# Altium project KUBODriver.PrjPcb
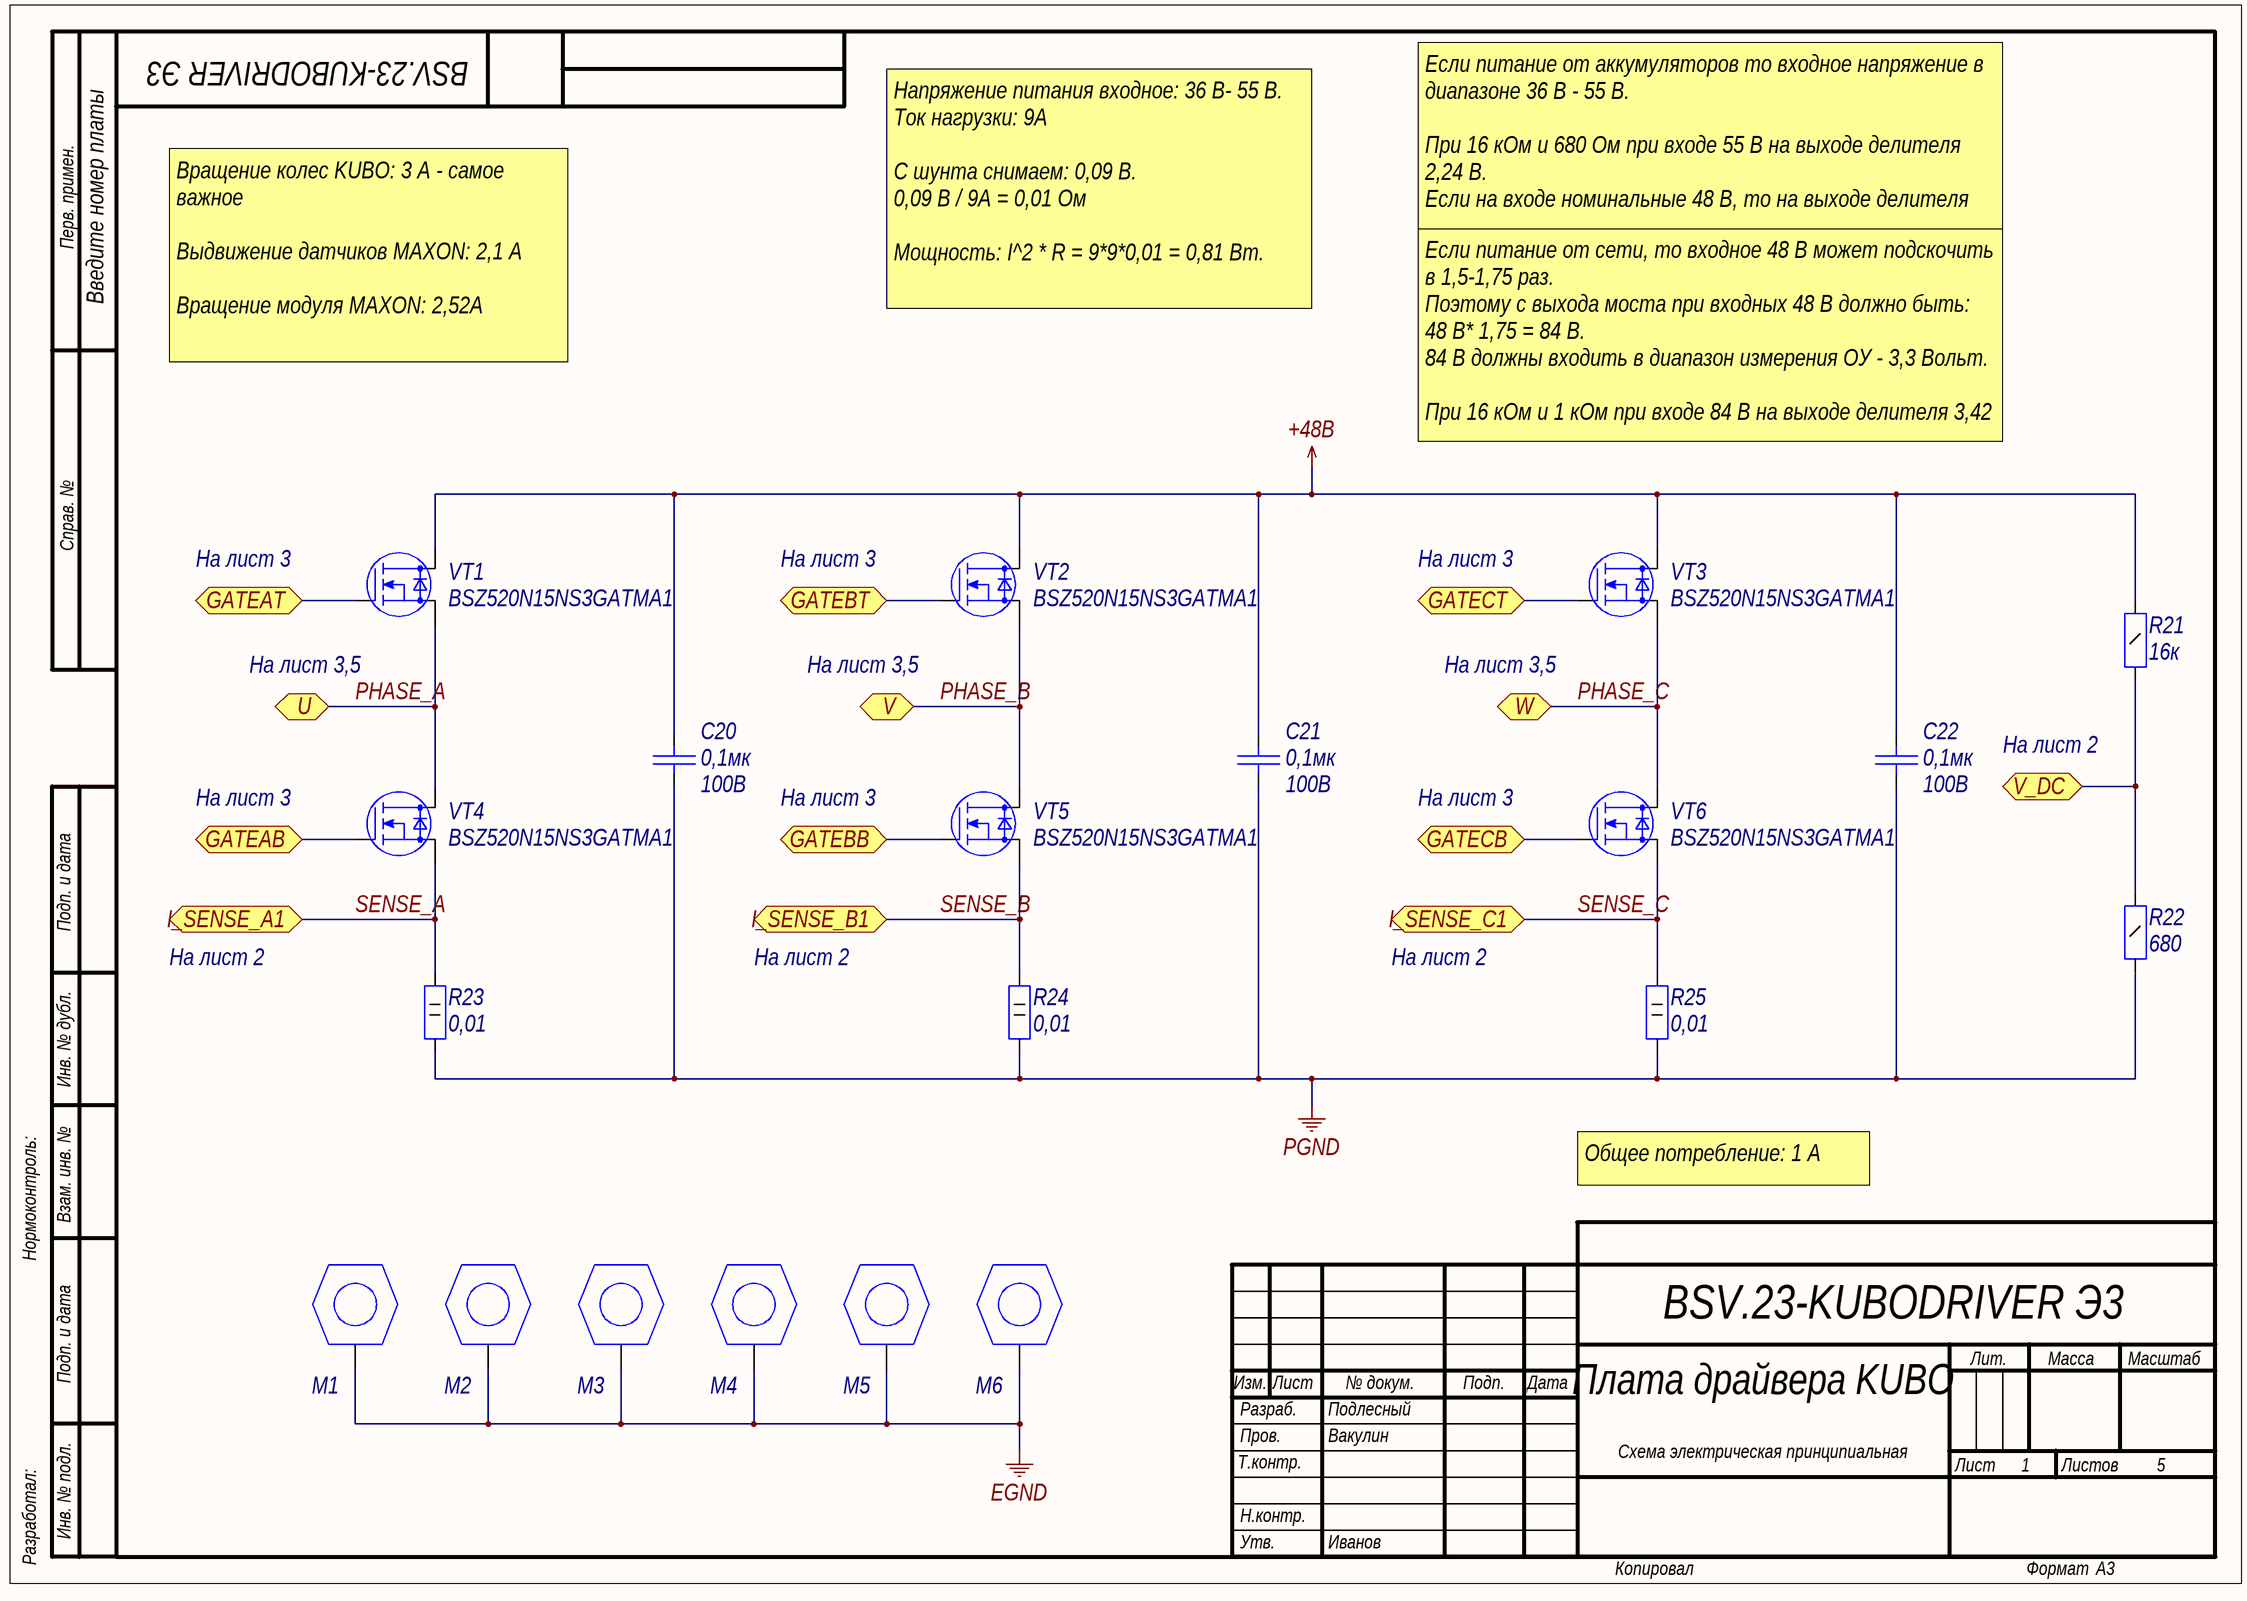
[diagram p0: KUBODriver_Bridge.SchDoc]
4 sheets, 155 parts. Net scope: flat (ports and power ports of the same name join across sheets).
Board file: KUBODriver.PcbDoc
Sheets:
  KUBODriver_Bridge.SchDoc
  KUBODriver_DC.SchDoc
  KUBODriver_Driver.SchDoc
  KUBODriver_MCU.SchDoc

## Sheet KUBODriver_Bridge.SchDoc: Плата драйвера KUBO
size 420 x 297 mm; ApprovedBy: Иванов; CheckedBy: Вакулин; DrawnBy: Подлесный; DocumentNumber: BSV.23-KUBODRIVER Э3; SheetNumber: 1; SheetTotal: 5; DocumentType: Схема электрическая принципиальная; Format: A3; ImagePath: Введите номер платы

### Parts
C20  Voltage: 100В  [C1206]  (hidden comment: 0,1мк)
C21  Voltage: 100В  [C1206]  (hidden comment: 0,1мк)
C22  Voltage: 100В  [C1206]  (hidden comment: 0,1мк)
M1  SCREW  [SCREW3]  (value not drawn)
M2  SCREW  [SCREW3]  (value not drawn)
M3  SCREW  [SCREW3]  (value not drawn)
M4  SCREW  [SCREW3]  (value not drawn)
M5  SCREW  [SCREW3]  (value not drawn)
M6  SCREW  [SCREW3]  (value not drawn)
R21  value 16к  [R1206]  (hidden comment: Resistor_0,25Вт)
R22  value 680  [R1206]  (hidden comment: Resistor_0,25Вт)
R23  0,01  [R2512]
R24  0,01  [R2512]
R25  0,01  [R2512]
VT1  Part Number: BSZ520N15NS3GATMA1  [TSDSON8]  (hidden comment: N-MOSFET)
VT2  Part Number: BSZ520N15NS3GATMA1  [TSDSON8]  (hidden comment: N-MOSFET)
VT3  Part Number: BSZ520N15NS3GATMA1  [TSDSON8]  (hidden comment: N-MOSFET)
VT4  Part Number: BSZ520N15NS3GATMA1  [TSDSON8]  (hidden comment: N-MOSFET)
VT5  Part Number: BSZ520N15NS3GATMA1  [TSDSON8]  (hidden comment: N-MOSFET)
VT6  Part Number: BSZ520N15NS3GATMA1  [TSDSON8]  (hidden comment: N-MOSFET)

### Ports
GATEAB, GATEAT, GATEBB, GATEBT, GATECB, GATECT, I_SENSE_A1, I_SENSE_B1, I_SENSE_C1, U, V, V_DC, W

### Nets
+48B: C20.2 C21.2 C22.2 R21.2 VT1.2(D) VT2.2(D) VT3.2(D)
EGND: M1.1 M2.1 M3.1 M4.1 M5.1 M6.1
PGND: C20.1 C21.1 C22.1 R22.1 R23.1 R24.1 R25.1
GATEAB: VT4.1(G) ; port GATEAB
GATEAT: VT1.1(G) ; port GATEAT
GATEBB: VT5.1(G) ; port GATEBB
GATEBT: VT2.1(G) ; port GATEBT
GATECB: VT6.1(G) ; port GATECB
GATECT: VT3.1(G) ; port GATECT
PHASE_A: VT1.3(S) VT4.2(D) ; port U
PHASE_B: VT2.3(S) VT5.2(D) ; port V
PHASE_C: VT3.3(S) VT6.2(D) ; port W
SENSE_A: R23.2 VT4.3(S) ; port I_SENSE_A1
SENSE_B: R24.2 VT5.3(S) ; port I_SENSE_B1
SENSE_C: R25.2 VT6.3(S) ; port I_SENSE_C1
V_DC: R21.1 R22.2 ; port V_DC

### Notes on the sheet
- Перв. примен.
- Если питание от аккумуляторов то входное напряжение в диапазоне 36 В - 55 B.
  При 16 кОм и 680 Ом при входе 55 В на выходе делителя 2,24 В.
  Если на входе номинальные 48 В, то на выходе делителя 1,96 В.
  Если на входе 36 В, то на выходе делителя 1,47 В.
- Напряжение питания входное: 36 B- 55 В.
  Ток нагрузки: 9А
  С шунта снимаем: 0,09 B.
  0,09 B / 9A = 0,01 Ом
  Мощность: I^2 * R = 9*9*0,01 = 0,81 Вт.
- Вращение колес KUBO: 3 А - самое важное
  Выдвижение датчиков MAXON: 2,1 А
  Вращение модуля MAXON: 2,52А
  Выдвижение УЗ датчика MAXON: 0,748А
- Если питание от сети, то входное 48 В может подскочить в 1,5-1,75 раз.
  Поэтому с выхода моста при входных 48 В должно быть:
  48 В* 1,75 = 84 В.
  84 В должны входить в диапазон измерения ОУ - 3,3 Вольт.
  При 16 кОм и 1 кОм при входе 84 В на выходе делителя 3,42 В.
- Справ. №
- На лист 3
- (near VT1) На лист 3,5
- (near VT2) На лист 3,5
- (near VT3) На лист 3,5
- На лист 2
- Подп. и дата
- Инв. № дубл.
- Нормоконтроль:
- Взам. инв. №
- Общее потребление: 1 A
- Изм.
- Лист
- № докум.
- Подп.
- Дата
- Лит.
- Масса
- Масштаб
- Т.контр.
- Пров.
- Разраб.
- Листов
- Разработал:
- Инв. № подл.
- Н.контр.
- Утв.
- Копировал
- Формат

### Library data of the parts
C20-C22 = cap286: Конденсатор; Part Name: Ceramic; Manufacture: Murata; Part Number: GRM31C5C2A104JA01L; id: cap286; TKE: NP0; Value: 0,1мк
M1-M6 = connect89: Part Name: Винт М3 с заземлением; id: connect89
R21 = res685: Резистор; Manufacture: Yageo; Part Number: RC1206FR-0716KL; id: res685; Accuracy: 0,01; Power: 0,25Вт; Part Name: Resistor
R22 = res652: Резистор; Manufacture: Yageo; Part Number: RC1206FR-07680RL; id: res652; Accuracy: 0,01; Power: 0,25Вт; Part Name: Resistor
R23-R25 = res1169: Резистор; Part Name: Shunt; Manufacture: Bourns; Part Number: CRA2512-FZ-R010ELF; Power: 2Вт; Value: 0,01; id: res1169; Accuracy: 0,01
VT1-VT6 = mosfert23: Manufacturer: Infineon Technologies; Structure: n-channel; V drain-source max: 150B; Rds: 0,052Ohm; Gate-to-source voltage: (+-)20B; Continuous drain current: 21A; Total gate charge: 12nC; Pulsed drain current: 84A; Power dissipation: 57W; id: mosfert23

## Sheet KUBODriver_DC.SchDoc
size 594 x 420 mm; DocumentNumber: BSV.23-KUBODRIVER Э3; SheetNumber: 3; Format: A2
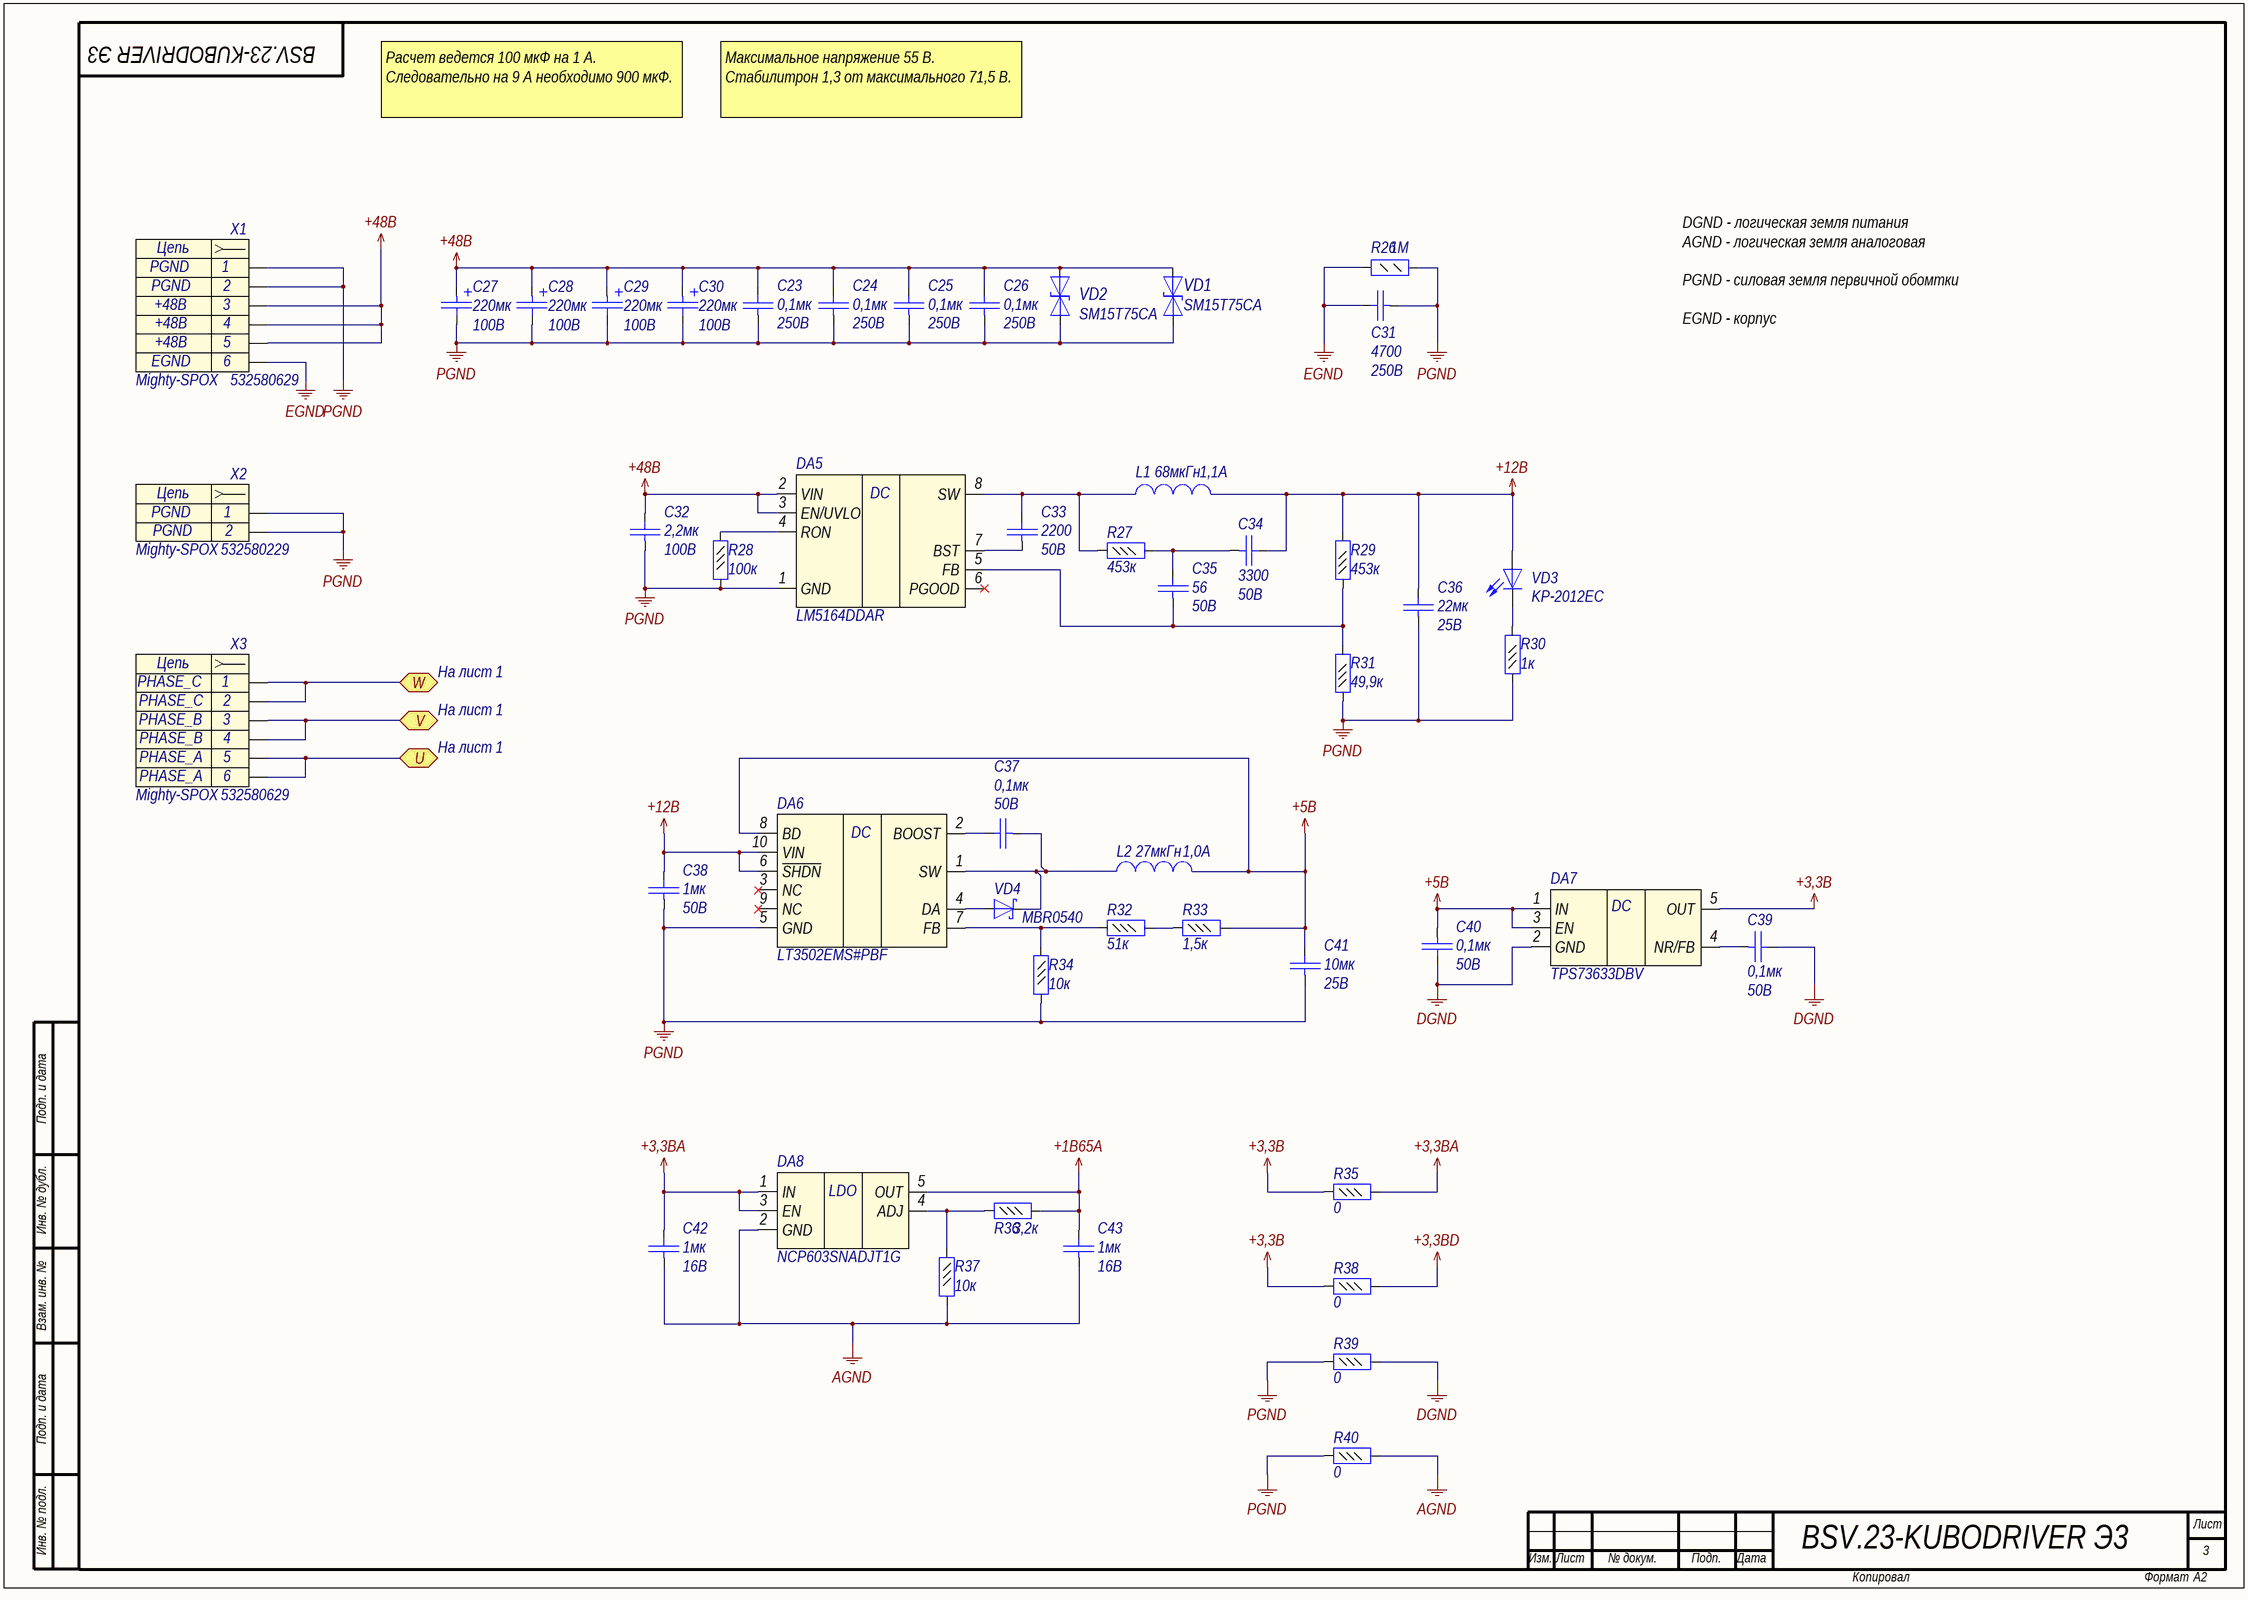
[diagram p1: KUBODriver_DC.SchDoc]

### Parts
C23  value 0,1мк  Voltage: 250В  [C1206]  (hidden comment: Capacitor)
C24  value 0,1мк  Voltage: 250В  [C1206]  (hidden comment: Capacitor)
C25  value 0,1мк  Voltage: 250В  [C1206]  (hidden comment: Capacitor)
C26  value 0,1мк  Voltage: 250В  [C1206]  (hidden comment: Capacitor)
C27  value 220мк  Voltage: 100B  [K50-35(12.5X25)_V]  (hidden comment: Capacitor_pol)
C28  value 220мк  Voltage: 100B  [K50-35(12.5X25)_V]  (hidden comment: Capacitor_pol)
C29  value 220мк  Voltage: 100B  [K50-35(12.5X25)_V]  (hidden comment: Capacitor_pol)
C30  value 220мк  Voltage: 100B  [K50-35(12.5X25)_V]  (hidden comment: Capacitor_pol)
C31  value 4700  Voltage: 250В  [C0805]  (hidden comment: Capacitor)
C32  Voltage: 100В  [C1210]  (hidden comment: 2,2мк)
C33  value 2200  Voltage: 50B  [C0402]  (hidden comment: Capacitor)
C34  value 3300  Voltage: 50В  [C0402]  (hidden comment: Capacitor)
C35  value 56  Voltage: 50B  [C0402]  (hidden comment: Capacitor)
C36  value 22мк  Voltage: 25B  [C1210]  (hidden comment: Capacitor)
C37  value 0,1мк  Voltage: 50В  [C0402]  (hidden comment: Capacitor)
C38  value 1мк  Voltage: 50B  [C0805]  (hidden comment: Capacitor)
C39  value 0,1мк  Voltage: 50В  [C0402]  (hidden comment: Capacitor)
C40  value 0,1мк  Voltage: 50В  [C0402]  (hidden comment: Capacitor)
C41  value 10мк  Voltage: 25В  [C1206]  (hidden comment: Capacitor)
C42  value 1мк  Voltage: 16B  [C0603]  (hidden comment: Capacitor)
C43  value 1мк  Voltage: 16B  [C0603]  (hidden comment: Capacitor)
DA5  Part Number: LM5164DDAR  [SO Powerpad8]  (hidden comment: LM5164)
DA6  Part Number: LT3502EMS#PBF  [MSOP10]  (hidden comment: LT3502_MS)
DA7  Part Number: TPS73633DBV  [SOT23-5]  (hidden comment: TPS736DBV)
DA8  Part Number: NCP603SNADJT1G  [TSOP5]  (hidden comment: NCP603)
L1  value 68мкГн  Rated Current: 1,1A  [SDR1006]  (hidden comment: Inductor)
L2  value 27мкГн  Rated Current: 1,0A  [SDR0604]  (hidden comment: Inductor)
R26  value 1М  [R0805]  (hidden comment: Resistor_0,125Вт)
R27  value 453к  [R0402]  (hidden comment: Resistor_0,062Вт)
R28  value 100к  [R0402]  (hidden comment: Resistor_0,062Вт)
R29  value 453к  [R0402]  (hidden comment: Resistor_0,062Вт)
R30  value 1к  [R0402]  (hidden comment: Resistor_0,062Вт)
R31  value 49,9к  [R0402]  (hidden comment: Resistor_0,062Вт)
R32  value 51к  [R0402]  (hidden comment: Resistor_0,062Вт)
R33  value 1,5к  [R0402]  (hidden comment: Resistor_0,062Вт)
R34  value 10к  [R0402]  (hidden comment: Resistor_0,062Вт)
R35  value 0  [R0603]  (hidden comment: Resistor_0,062Вт)
R36  value 3,2к  [R0402]  (hidden comment: Resistor_0,062Вт)
R37  value 10к  [R0402]  (hidden comment: Resistor_0,062Вт)
R38  value 0  [R0603]  (hidden comment: Resistor_0,062Вт)
R39  value 0  [R0603]  (hidden comment: Resistor_0,062Вт)
R40  value 0  [R0603]  (hidden comment: Resistor_0,062Вт)
VD1  Part Number: SM15T75CA  [SMC]  (hidden comment: DiodeZenerDual)
VD2  Part Number: SM15T75CA  [SMC]  (hidden comment: DiodeZenerDual)
VD3  Part Number: KP-2012EC  [L_0805]  (hidden comment: LED)
VD4  Part Number: MBR0540  [SOD-123]  (hidden comment: DiodeSchottky)
X1  Part Name: Mighty-SPOX  Part Number: 532580629  [MOLEX_532580629]  (hidden comment: Header_6_sct)
X2  Part Name: Mighty-SPOX  Part Number: 532580229  [MOLEX_532580229]  (hidden comment: Header_2_sct)
X3  Part Name: Mighty-SPOX  Part Number: 532580629  [MOLEX_532580629]  (hidden comment: Header_6_sct)

### Ports
U, V, W

### Nets
+1B65A: C43.2 DA8.5(OUT) R36.2
+3,3B: DA7.5(OUT) R35.1 R38.1
+3,3BA: C42.2 DA8.1(IN) DA8.3(EN) R35.2
+3,3BD: R38.2
+5B: C40.1 C41.2 DA6.8(BD) DA7.1(IN) DA7.3(EN) L2.2 R33.2
+12B: C34.2 C36.2 C38.2 DA6.6(~{SHDN}) DA6.10(VIN) L1.2 R29.2 VD3.2(A)
+48B: C23.2 C24.2 C25.2 C26.2 C27.1 C28.1 C29.1 C30.1 C32.2 DA5.2(VIN) DA5.3(EN/UVLO) VD1.1(K) VD2.2(A) X1.3 X1.4 X1.5
AGND: C42.1 C43.1 DA8.2(GND) R37.2 R40.2
DGND: C39.2 C40.2 DA7.2(GND) R39.2
EGND: C31.2 R26.2 X1.6
PGND: C23.1 C24.1 C25.1 C26.1 C27.2 C28.2 C29.2 C30.2 C31.1 C32.1 C36.1 C38.1 C41.1 DA5.1(GND) DA6.5(GND) R26.1 R28.2 R30.1 R31.1 R34.2 R39.1 R40.1 VD1.2(A) VD2.1(K) X1.1 X1.2 X2.1 X2.2
PHASE_A: X3.5 X3.6 ; port U
PHASE_B: X3.3 X3.4 ; port V
PHASE_C: X3.1 X3.2 ; port W
NetC33_1: C33.1 DA5.7(BST)
NetC33_2: C33.2 DA5.8(SW) L1.1 R27.1
NetC34_1: C34.1 C35.2 R27.2
NetC35_1: C35.1 DA5.5(FB) R29.1 R31.2
NetC37_1: C37.1 DA6.1(SW) L2.1 VD4.1(K)
NetC37_2: C37.2 DA6.2(BOOST)
NetC39_1: C39.1 DA7.4(NR/FB)
NetDA5_4: DA5.4(RON) R28.1
NetDA6_4: DA6.4(DA) VD4.2(A)
NetDA6_7: DA6.7(FB) R32.1 R34.1
NetDA8_4: DA8.4(ADJ) R36.1 R37.1
NetR30_2: R30.2 VD3.1(K)
NetR32_2: R32.2 R33.1

Not connected (* = marked no-connect by the designer): DA5 6(PGOOD)*; DA6 3(NC)* 9(NC)*

### Notes on the sheet
- Расчет ведется 100 мкФ на 1 А.
  Следовательно на 9 А необходимо 900 мкФ.
- Максимальное напряжение 55 В.
  Стабилитрон 1,3 от максимального 71,5 В.
- DGND - логическая земля питания
  AGND - логическая земля аналоговая
  PGND - силовая земля первичной обомтки
  EGND - корпус
- На лист 1
- Подп. и дата
- Инв. № дубл.
- Взам. инв. №
- Инв. № подл.
- Лист
- Изм.
- № докум.
- Подп.
- Дата
- Копировал
- Формат
- (in symbol connect103) Цепь
- (in symbol connect105) Цепь
- (in symbol pwr102) DC
- (in symbol pwr112) DC
- (in symbol pwr113) DC
- (in symbol pwr124) LDO

### Library data of the parts
C23-C26 = cap179: Конденсатор; Part Name: Ceramic; Manufacture: Murata; Part Number: GRM31CR72E104K; id: cap179; TKE: X7R
C27-C30 = cap279: Конденсатор полярный; Part Name: Electrolit; Manufacture: Epcos; Part Number: B41851A9227M000; id: cap279; tga: 0,10%; ESR: 75мОм; Iac max: 0,4А; Iac rated: 0,6А
C31 = cap211: Конденсатор; Part Name: Ceramic; Manufacture: Murata; Part Number: GRM21AR72E472KW; id: cap211; TKE: X7R
C32 = cap288: Конденсатор; Part Name: Ceramic; Manufacture: Murata; Part Number: GCJ32DR72A225KA01L; id: cap288; TKE: X7R; tga: 0,10%; Value: 2,2мк
C33 = cap34: Конденсатор; Part Name: Ceramic; Manufacture: Murata; Part Number: GRM155R71H222K; id: cap34; TKE: X7R
C34 = cap283: Конденсатор; Part Name: Ceramic; Manufacture: Murata; Part Number: GRM155R71H332KA01D; id: cap283; TKE: NP0; tga: 0,10%
C35 = cap16: Конденсатор; Part Name: Ceramic; Manufacture: Murata; Part Number: GRM1555C1H560J*; id: cap16; TKE: NP0
C36 = cap280: Конденсатор; Part Name: MLCC; Manufacture: Taiyo Yuden; Part Number: TMK325B7226KMHT; id: cap280; TKE: X7R; tga: 0,10%
C37 C39 C40 = cap277: Конденсатор; Part Name: Ceramic; Manufacture: Murata; Part Number: GRM155R71H104KE14D; id: cap277; TKE: X7R; tga: 0,10%
C38 = cap151: Конденсатор; Part Name: Ceramic; Manufacture: Murata; Part Number: GRM21BR71H105K; id: cap151; TKE: X7R
C41 = cap186: Конденсатор; Part Name: Ceramic; Manufacture: Murata; Part Number: GRM31CR71E106KA12L*; id: cap186; TKE: X7R
C42 C43 = cap133: Конденсатор; Part Name: Ceramic; Manufacture: Murata; Part Number: GRM188R71C105KA12D**; id: cap133; TKE: X7R
DA5 = pwr102: 1-A synchronous buck DC/DC converter with ultra-low IQ; Manufacturer: Texas Instruments; id: pwr102; Input Voltage: 6B-100B; Output Voltage: 1,2B-90B; Current: 1A; Frequency: 1MHz; Part Name: 1-A synchronous buck DC/DC converter with ultra-low IQ; Type: Impulse
DA6 = pwr112: 1.1MHz/2.2MHz, 500mA  Step-Down Regulators; Part Name: 1-A synchronous buck DC/DC converter with ultra-low IQ; Manufacturer: Linear Technology; id: pwr112; Input Voltage: 40B; Output Voltage: Adj; Current: 0,5А; Frequency: 2,2MHz; Type: Impulse
DA7 = pwr113: 400-mA Low-Dropout Regulator with Reverse Current  Protection; Manufacturer: Texas Instruments; id: pwr113; Input Voltage: 1,7-5,5В; Output Voltage: 3,3B; Dropout Voltage: 75mB; Current: 400mA; Part Name: Low-Dropout Regulator with Reverse Current Protection; Type: Linear
DA8 = pwr124: High Performance  CMOS LDO Regulator with  Enable and Enhanced ESD  Protection; Part Name: High Performance LDO Regulator with ESD Protection; Manufacturer: ON Semiconductor; id: pwr124; Input Voltage: 1,7-6В; Output Voltage: Adj; Dropout Voltage: 175mB; Current: 300mA; Type: Linear
L1 = ind109: EMI Suppression Filter; Part Name: SMD Power Inductors; Part Number: SDR1006- 680KL; Manufacture: Bourns; id: ind109; Saturation Current: 2,0A; Resistance: 0,22Ohm
L2 = ind47: EMI Suppression Filter; Part Name: SMD Power Inductors; Part Number: SDR0604- 270YL; Manufacture: Bourns; id: ind47; Saturation Current: 1,3A; Resistance: 0,22Ohm
R26 = res149: Резистор; Manufacture: Yageo; Part Number: RC0805FR-071ML; id: res149; Accuracy: 0,01; Part Name: Resistor; Power: 0,125Вт
R27 R29 = res1155: Резистор; Manufacture: Yageo; Part Number: RC0402FR-07453KL; Accuracy: 0,01; id: res1155; Part Name: Resistor; Power: 0,062Вт
R28 = res318: Резистор; Manufacture: Yageo; Part Number: RC0402FR-07100KL; id: res318; Accuracy: 0,01; Part Name: Resistor; Power: 0,062Вт
R30 = res270: Резистор; Manufacture: Yageo; Part Number: RC0402FR-071KL; id: res270; Accuracy: 0,01; Part Name: Resistor; Power: 0,062Вт
R31 = res1159: Резистор; Manufacture: Yageo; Part Number: RC0402FR-0749K9L; Accuracy: 0,01; id: res1159; Part Name: Resistor; Power: 0,062Вт
R32 = res311: Резистор; Manufacture: Yageo; Part Number: RC0402FR-0751KL; id: res311; Accuracy: 0,01; Part Name: Resistor; Power: 0,062Вт
R33 = res274: Резистор; Manufacture: Yageo; Part Number: RC0402FR-071K5; id: res274; Accuracy: 0,01; Part Name: Resistor; Power: 0,062Вт
R34 R37 = res294: Резистор; Manufacture: Yageo; Part Number: RC0402FR-0710KL; id: res294; Accuracy: 0,01; Part Name: Resistor; Power: 0,062Вт
R35 R38-R40 = res390: Резистор; Manufacture: Yageo; Part Number: RC0603FR-070RL; id: res390; Accuracy: 0,01; Part Name: Resistor; Power: 0,062Вт
R36 = res1170: Резистор; Manufacture: Yageo; Part Number: RT0402BRD073K2L; Accuracy: 0,01; id: res1170; Part Name: Resistor; Power: 0,062Вт
VD1 VD2 = SM15T75CA: Cтабилитрон (диод выпрямительный лавинный) двусторонний; Part Name: TVS diode Bidirectional; Manufacture: ST Microelectronics; id: tvs280; Leakage Current: 0.2uA; Stand-off Voltage: 71.3B; Breakdown Voltage: 75B; Clamping voltage: 78.8B; Peak Pulse Power: 1500W; Number of diodes: 1
VD3 = diode5: Светодиод; id: diode5; Part Name: LED
VD4 = diode15: Диод Шоттки; Manufacture: ON Semiconductor; Max Reverse Voltage: 40B; Forward Voltage: 0,62B; Forward Current: 0,5А; Capacitance: 30pF; Number of Channels: 1; id: diode15; Part Name: Diode Schottky
X1 = connect103: Разъем - 6 конт. розетка; Manufacture: Molex; Contact_1: PGND; Contact_3: +48B; Contact_6: EGND; Etch: 3.5mm; Contact_2: PGND; Contact_4: +48B; Contact_5: +48B; id: connect103
X2 = connect105: Разъем - 2 конт. розетка; Manufacture: Molex; Contact_1: PGND; Etch: 3.5mm; Contact_2: PGND; id: connect105
X3 = connect103: Разъем - 6 конт. розетка; Manufacture: Molex; Contact_1: PHASE_C; Contact_3: PHASE_B; Contact_5: PHASE_A; Etch: 3.5mm; Contact_2: PHASE_C; Contact_4: PHASE_B; Contact_6: PHASE_A; id: connect103

## Sheet KUBODriver_Driver.SchDoc
size 420 x 297 mm; DocumentNumber: BSV.23-KUBODRIVER Э3; SheetNumber: 4; Format: A3
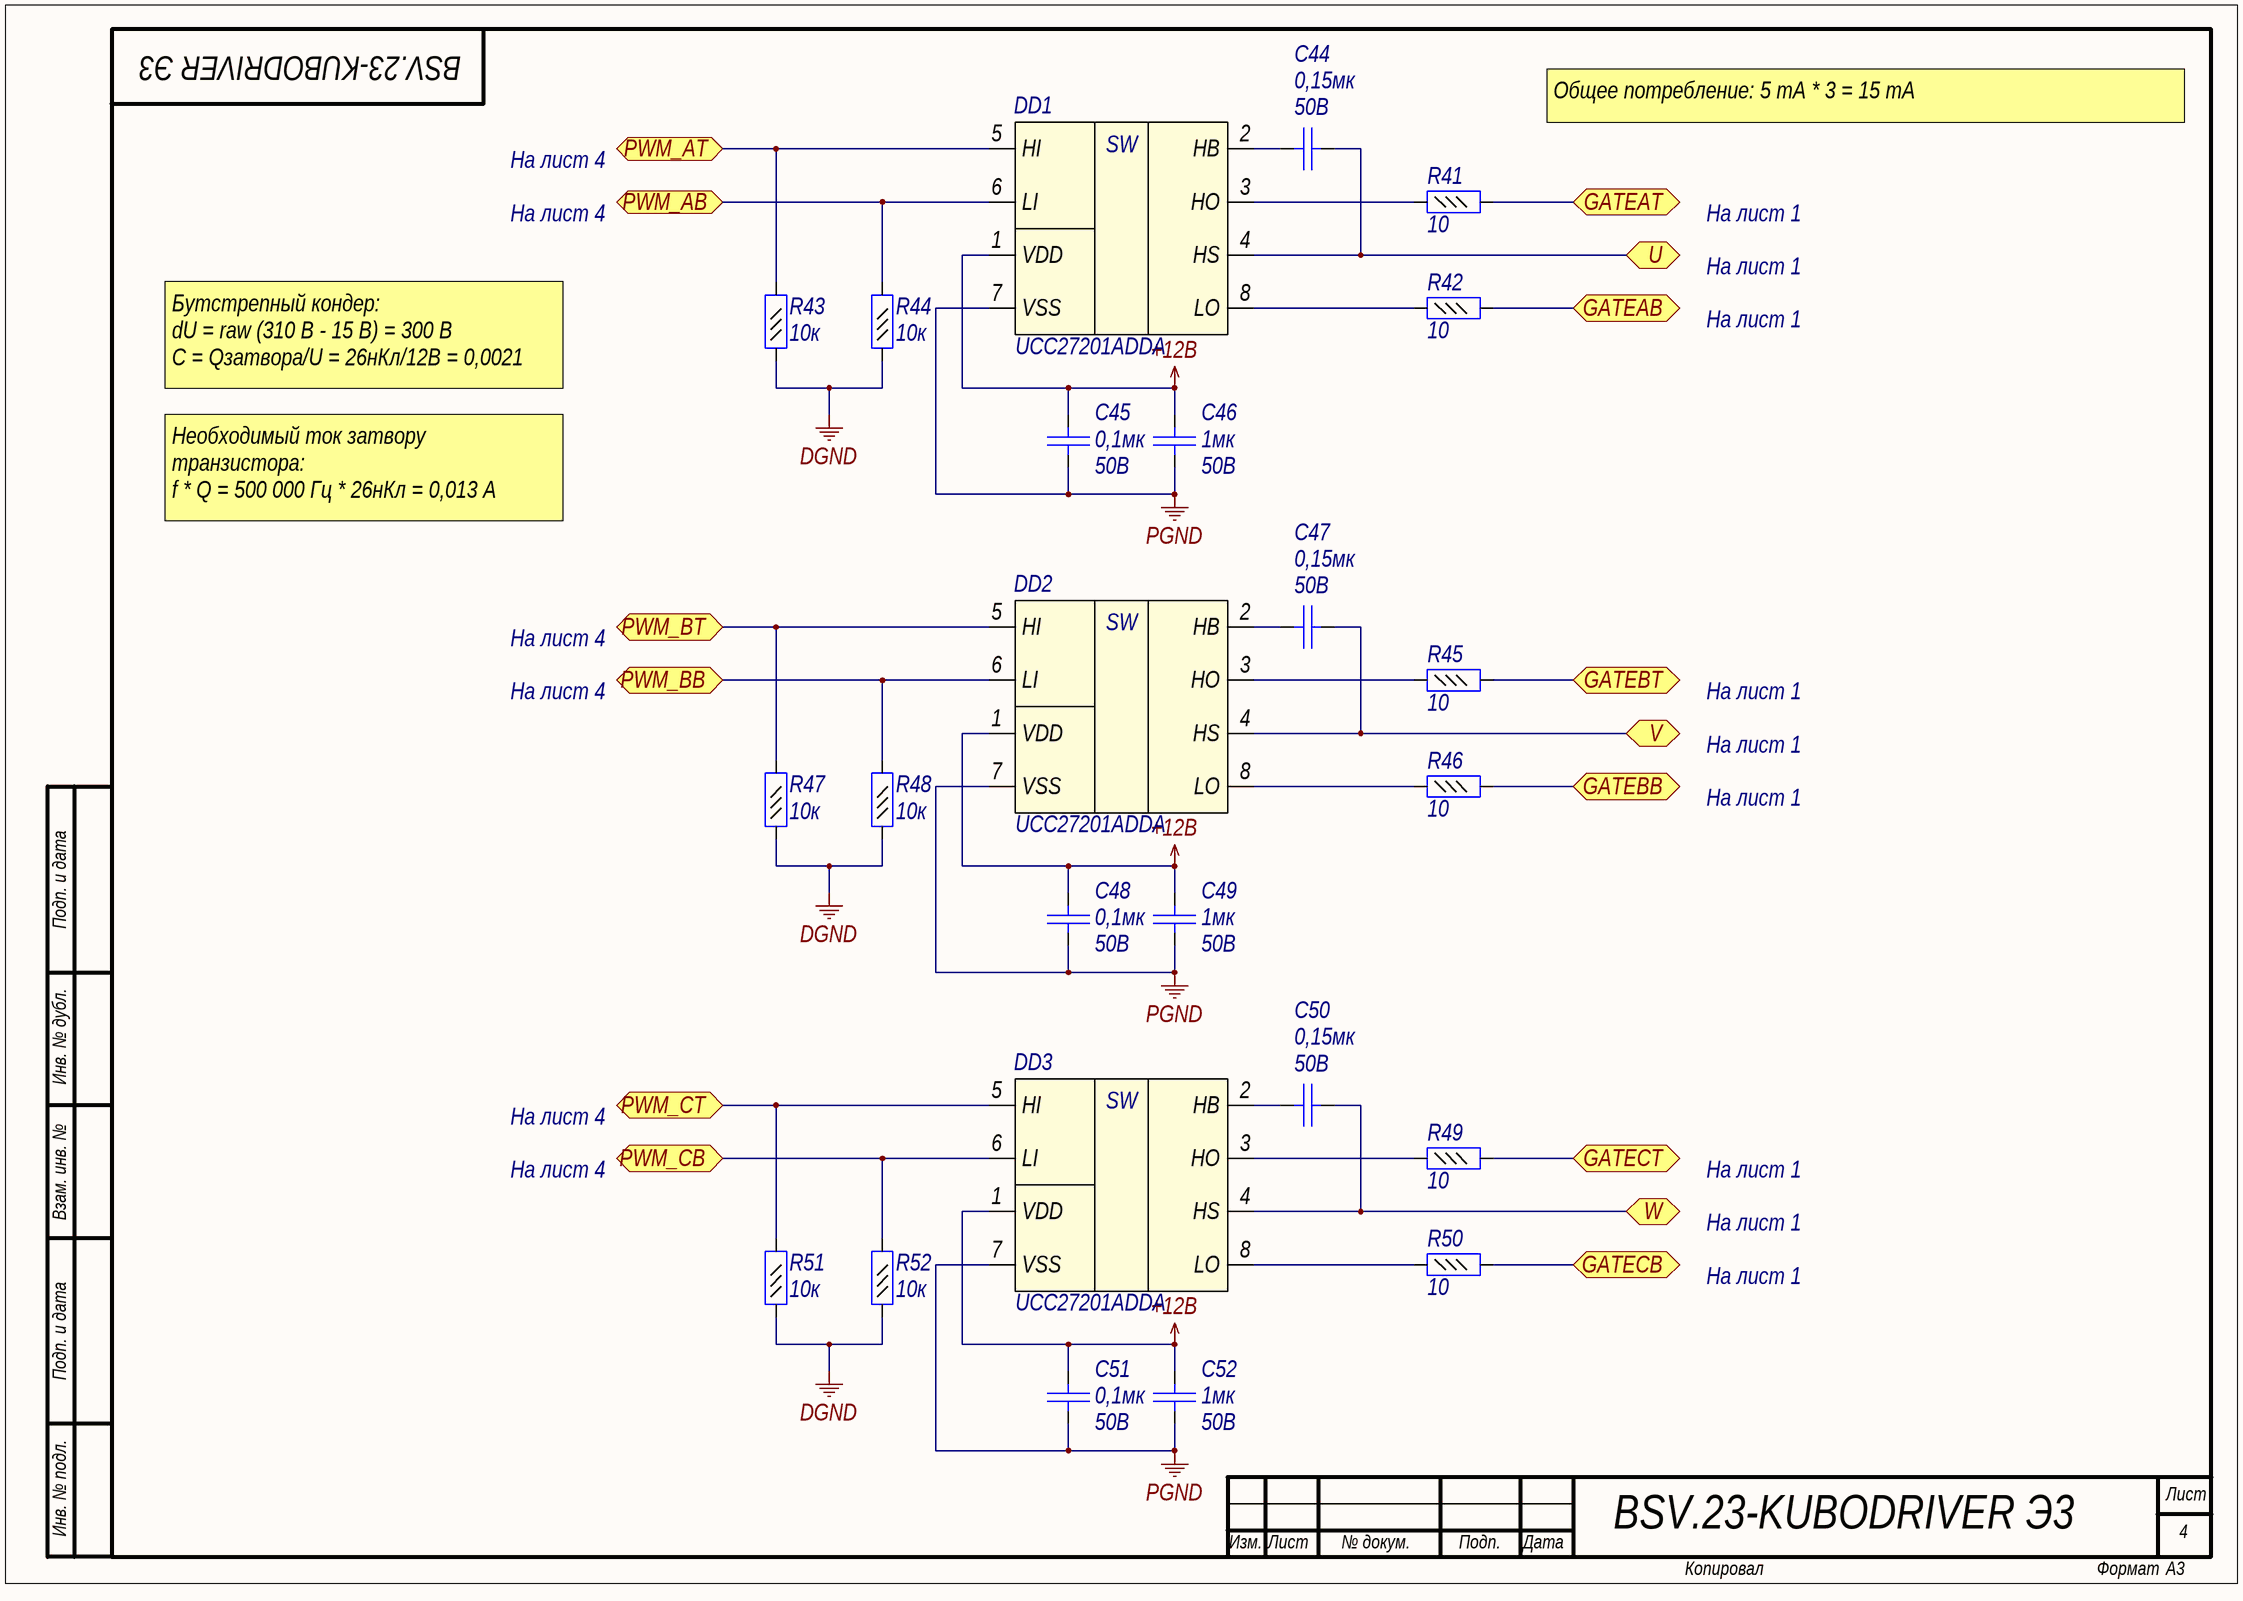
[diagram p2: KUBODriver_Driver.SchDoc]

### Parts
C44  Voltage: 50В  [C1812]  (hidden comment: 0,15мк)
C45  value 0,1мк  Voltage: 50В  [C0402]  (hidden comment: Capacitor)
C46  value 1мк  Voltage: 50B  [C0805]  (hidden comment: Capacitor)
C47  Voltage: 50В  [C1812]  (hidden comment: 0,15мк)
C48  value 0,1мк  Voltage: 50В  [C0402]  (hidden comment: Capacitor)
C49  value 1мк  Voltage: 50B  [C0805]  (hidden comment: Capacitor)
C50  Voltage: 50В  [C1812]  (hidden comment: 0,15мк)
C51  value 0,1мк  Voltage: 50В  [C0402]  (hidden comment: Capacitor)
C52  value 1мк  Voltage: 50B  [C0805]  (hidden comment: Capacitor)
DD1  Part Number: UCC27201ADDA  [HSOP8]  (hidden comment: UCC27201A)
DD2  Part Number: UCC27201ADDA  [HSOP8]  (hidden comment: UCC27201A)
DD3  Part Number: UCC27201ADDA  [HSOP8]  (hidden comment: UCC27201A)
R41  value 10  [R0402]  (hidden comment: Resistor_0,062Вт)
R42  value 10  [R0402]  (hidden comment: Resistor_0,062Вт)
R43  value 10к  [R0402]  (hidden comment: Resistor_0,062Вт)
R44  value 10к  [R0402]  (hidden comment: Resistor_0,062Вт)
R45  value 10  [R0402]  (hidden comment: Resistor_0,062Вт)
R46  value 10  [R0402]  (hidden comment: Resistor_0,062Вт)
R47  value 10к  [R0402]  (hidden comment: Resistor_0,062Вт)
R48  value 10к  [R0402]  (hidden comment: Resistor_0,062Вт)
R49  value 10  [R0402]  (hidden comment: Resistor_0,062Вт)
R50  value 10  [R0402]  (hidden comment: Resistor_0,062Вт)
R51  value 10к  [R0402]  (hidden comment: Resistor_0,062Вт)
R52  value 10к  [R0402]  (hidden comment: Resistor_0,062Вт)

### Ports
GATEAB, GATEAT, GATEBB, GATEBT, GATECB, GATECT, PWM_AB, PWM_AT, PWM_BB, PWM_BT, PWM_CB, PWM_CT, U, V, W

### Nets
+12B: C45.2 C46.2 C48.2 C49.2 C51.2 C52.2 DD1.1(VDD) DD2.1(VDD) DD3.1(VDD)
DGND: R43.1 R44.1 R47.1 R48.1 R51.1 R52.1
PGND: C45.1 C46.1 C48.1 C49.1 C51.1 C52.1 DD1.7(VSS) DD2.7(VSS) DD3.7(VSS)
GATEAB: R42.2 ; port GATEAB
GATEAT: R41.2 ; port GATEAT
GATEBB: R46.2 ; port GATEBB
GATEBT: R45.2 ; port GATEBT
GATECB: R50.2 ; port GATECB
GATECT: R49.2 ; port GATECT
PHASE_A: C44.2 DD1.4(HS) ; port U
PHASE_B: C47.2 DD2.4(HS) ; port V
PHASE_C: C50.2 DD3.4(HS) ; port W
PWM_AB: DD1.6(LI) R44.2 ; port PWM_AB
PWM_AT: DD1.5(HI) R43.2 ; port PWM_AT
PWM_BB: DD2.6(LI) R48.2 ; port PWM_BB
PWM_BT: DD2.5(HI) R47.2 ; port PWM_BT
PWM_CB: DD3.6(LI) R52.2 ; port PWM_CB
PWM_CT: DD3.5(HI) R51.2 ; port PWM_CT
NetC44_1: C44.1 DD1.2(HB)
NetC47_1: C47.1 DD2.2(HB)
NetC50_1: C50.1 DD3.2(HB)
NetDD1_3: DD1.3(HO) R41.1
NetDD1_8: DD1.8(LO) R42.1
NetDD2_3: DD2.3(HO) R45.1
NetDD2_8: DD2.8(LO) R46.1
NetDD3_3: DD3.3(HO) R49.1
NetDD3_8: DD3.8(LO) R50.1

### Notes on the sheet
- Общее потребление: 5 mA * 3 = 15 mA
- На лист 4
- На лист 1
- Бутстрепный кондер:
  dU = raw (310 B - 15 B) = 300 B
  C = Qзатвора/U = 26нКл/12В = 0,0021 мкФ
- Необходимый ток затвору транзистора:
  f * Q = 500 000 Гц * 26нКл = 0,013 А
  Ток на затвор = 12В / 10 ом = 1,2 А
- Подп. и дата
- Инв. № дубл.
- Взам. инв. №
- Инв. № подл.
- Лист
- Изм.
- № докум.
- Подп.
- Дата
- Копировал
- Формат
- (in symbol driver25) SW

### Library data of the parts
C44 C47 C50 = cap285: Конденсатор; Part Name: Ceramic; Manufacture: TDK; Part Number: C4532C0G1H154J250KA; id: cap285; TKE: NP0; Value: 0,15мк
C45 C48 C51 = cap277: as C37 on sheet KUBODriver_DC
C46 C49 C52 = cap151: as C38 on sheet KUBODriver_DC
DD1-DD3 = driver25: 120-V Boot, 3-A Peak, High-Frequency, High-Side and Low-Side Driver; Part Name: High-Side/Low-Side Driver; Manufacture: Texas Instruments; Logic High: 1,6B-2,5B; Logic Low: 0,8B-1,6B; Min Operating Supply Voltage: 8B; Max Operating Supply Voltage: 17B; Vbus: 120B; “A” OUTPUT: Noninverting; Maximum output current: 3A; Maximum Power Dissipation: 2,7W; id: driver25; “B” OUTPUT: Noninverting
R41 R42 R45 R46 R49 R50 = res222: Резистор; Manufacture: Yageo; Part Number: RC0402FR-0710RL; id: res222; Accuracy: 0,01; Part Name: Resistor; Power: 0,062Вт
R43 R44 R47 R48 R51 R52 = res294: as R34 on sheet KUBODriver_DC; Part Name: Resistor; Power: 0,062Вт

## Sheet KUBODriver_MCU.SchDoc
size 840 x 594 mm; DocumentNumber: BSV.23-KUBODRIVER Э3; SheetNumber: 5; Format: A1
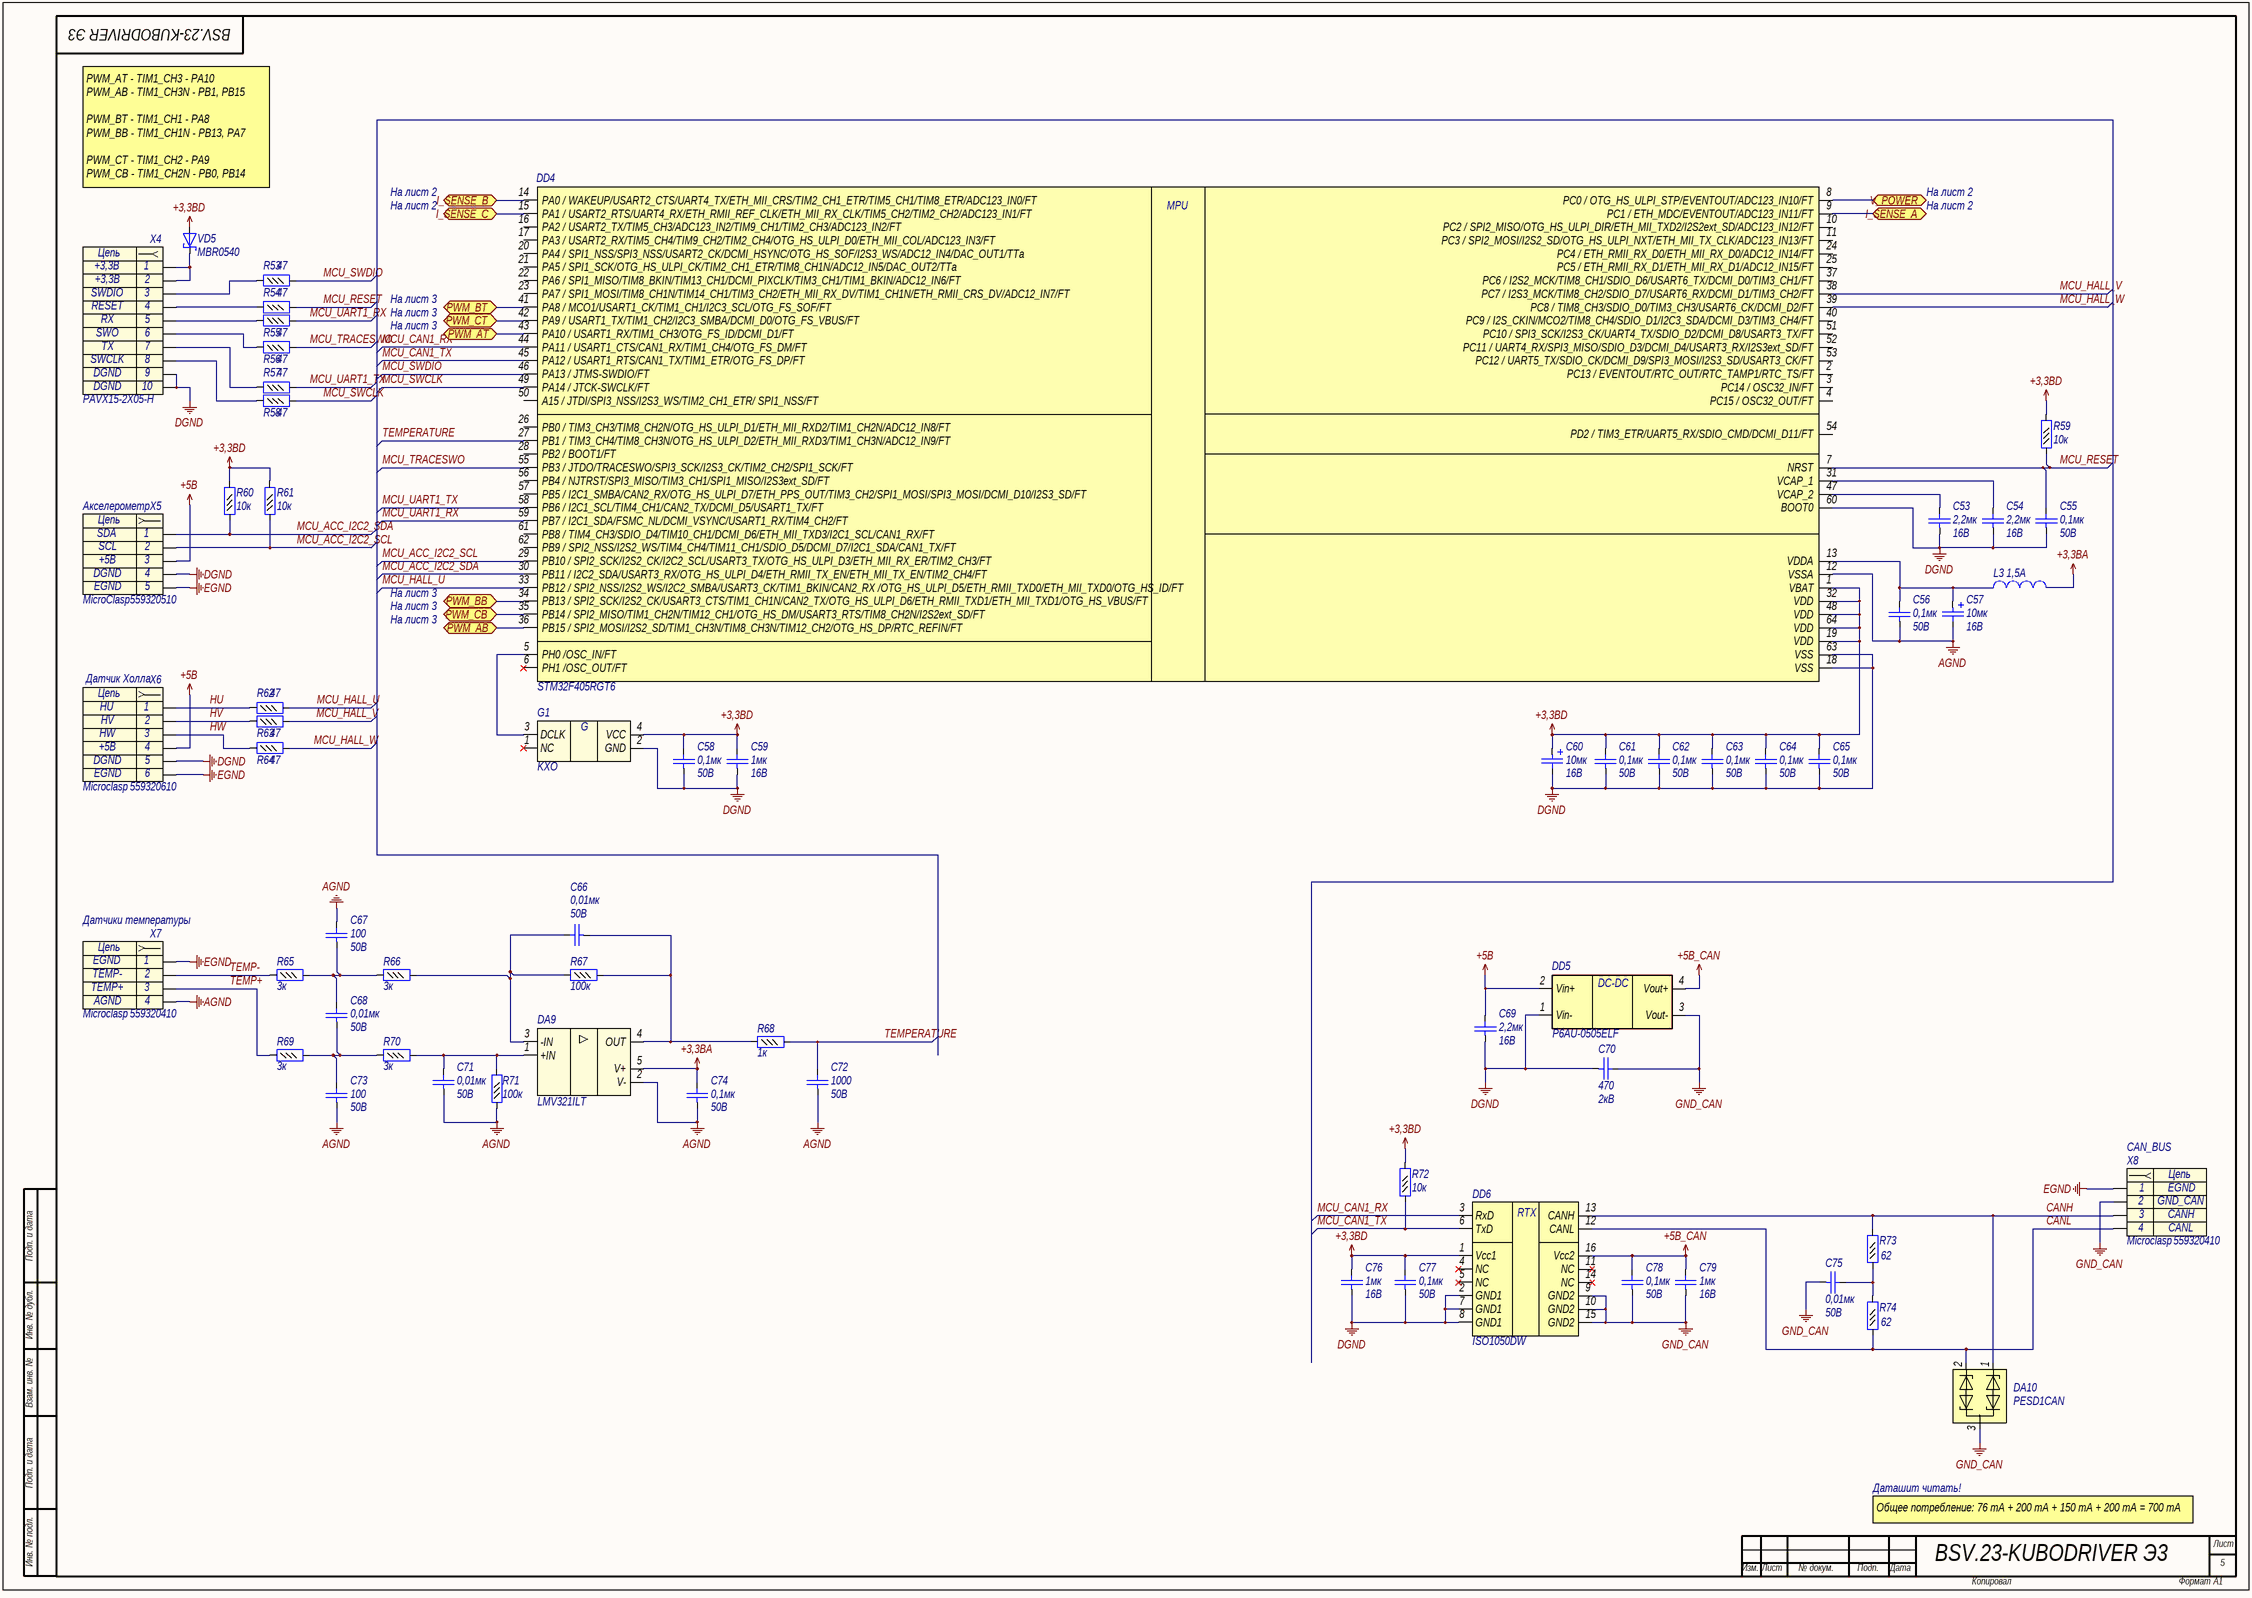
[diagram p3: KUBODriver_MCU.SchDoc]

### Parts
C53  Voltage: 16B  [C0603]  (hidden comment: 2,2мк)
C54  Voltage: 16B  [C0603]  (hidden comment: 2,2мк)
C55  value 0,1мк  Voltage: 50В  [C0402]  (hidden comment: Capacitor)
C56  value 0,1мк  Voltage: 50В  [C0402]  (hidden comment: Capacitor)
C57  value 10мк  Voltage: 16В  [TANTAL CASE A]  (hidden comment: Capacitor_pol)
C58  value 0,1мк  Voltage: 50В  [C0402]  (hidden comment: Capacitor)
C59  value 1мк  Voltage: 16B  [C0603]  (hidden comment: Capacitor)
C60  value 10мк  Voltage: 16В  [TANTAL CASE A]  (hidden comment: Capacitor_pol)
C61  value 0,1мк  Voltage: 50В  [C0402]  (hidden comment: Capacitor)
C62  value 0,1мк  Voltage: 50В  [C0402]  (hidden comment: Capacitor)
C63  value 0,1мк  Voltage: 50В  [C0402]  (hidden comment: Capacitor)
C64  value 0,1мк  Voltage: 50В  [C0402]  (hidden comment: Capacitor)
C65  value 0,1мк  Voltage: 50В  [C0402]  (hidden comment: Capacitor)
C66  value 0,01мк  Voltage: 50B  [C0402]  (hidden comment: Capacitor)
C67  value 100  Voltage: 50B  [C0402]  (hidden comment: Capacitor)
C68  value 0,01мк  Voltage: 50B  [C0402]  (hidden comment: Capacitor)
C69  Voltage: 16B  [C0603]  (hidden comment: 2,2мк)
C70  value 470  Voltage: 2кВ  [C1206]  (hidden comment: Capacitor)
C71  value 0,01мк  Voltage: 50B  [C0402]  (hidden comment: Capacitor)
C72  value 1000  Voltage: 50B  [C0402]  (hidden comment: Capacitor)
C73  value 100  Voltage: 50B  [C0402]  (hidden comment: Capacitor)
C74  value 0,1мк  Voltage: 50В  [C0402]  (hidden comment: Capacitor)
C75  value 0,01мк  Voltage: 50B  [C0402]  (hidden comment: Capacitor)
C76  value 1мк  Voltage: 16B  [C0603]  (hidden comment: Capacitor)
C77  value 0,1мк  Voltage: 50В  [C0402]  (hidden comment: Capacitor)
C78  value 0,1мк  Voltage: 50В  [C0402]  (hidden comment: Capacitor)
C79  value 1мк  Voltage: 16B  [C0603]  (hidden comment: Capacitor)
DA9  LMV321ILT  [SOT23-5]
DA10  Part Number: PESD1CAN  [SOT23-3]  (hidden comment: PESD)
DD4  STM32F405RGT6  [LQFP64]
DD5  Part Number: P6AU-0505ELF  [SIP4]  (hidden comment: P6AU-xxxxELF)
DD6  (no value)  [SO16]
G1  KXO  [QSMD7x5.2x1.8]
L3  Rated Current: 1,5A  [L0603]  (hidden comment: Inductor)
R53  value 47  [R0402]  (hidden comment: Resistor_0,062Вт)
R54  value 47  [R0402]  (hidden comment: Resistor_0,062Вт)
R55  value 47  [R0402]  (hidden comment: Resistor_0,062Вт)
R56  value 47  [R0402]  (hidden comment: Resistor_0,062Вт)
R57  value 47  [R0402]  (hidden comment: Resistor_0,062Вт)
R58  value 47  [R0402]  (hidden comment: Resistor_0,062Вт)
R59  value 10к  [R0402]  (hidden comment: Resistor_0,062Вт)
R60  value 10к  [R0402]  (hidden comment: Resistor_0,062Вт)
R61  value 10к  [R0402]  (hidden comment: Resistor_0,062Вт)
R62  value 47  [R0402]  (hidden comment: Resistor_0,062Вт)
R63  value 47  [R0402]  (hidden comment: Resistor_0,062Вт)
R64  value 47  [R0402]  (hidden comment: Resistor_0,062Вт)
R65  value 3к  [R0402]  (hidden comment: Resistor_0,062Вт)
R66  value 3к  [R0402]  (hidden comment: Resistor_0,062Вт)
R67  value 100к  [R0402]  (hidden comment: Resistor_0,062Вт)
R68  value 1к  [R0402]  (hidden comment: Resistor_0,062Вт)
R69  value 3к  [R0402]  (hidden comment: Resistor_0,062Вт)
R70  value 3к  [R0402]  (hidden comment: Resistor_0,062Вт)
R71  value 100к  [R0402]  (hidden comment: Resistor_0,062Вт)
R72  value 10к  [R0402]  (hidden comment: Resistor_0,062Вт)
R73  value 62  [R0402]  (hidden comment: Resistor_0,062Вт)
R74  value 62  [R0402]  (hidden comment: Resistor_0,062Вт)
VD5  Part Number: MBR0540  [SOD-123]  (hidden comment: DiodeSchottky)
X4  Header_10_sct  [PAVX15-2X05-H]  (value not drawn)
X5  Акселерометр  Part Name: MicroClasp  Part Number: 559320510  [MOLEX_559320510]
X6  Датчик Холла  Part Number: 559320610  [MOLEX_559320610]
X7  Датчики температуры  Part Number: 559320410  [MOLEX_559320410]
X8  CAN_BUS  Part Number: 559320410  [MOLEX_559320410]

### Ports
I_SENSE_A, I_SENSE_B, I_SENSE_C, PWM_AB, PWM_AT, PWM_BB, PWM_BT, PWM_CB, PWM_CT, V_POWER

### Nets
+3,3BA: C74.2 DA9.5(V+) L3.2
+3,3BD: C58.2 C59.2 C60.1 C61.2 C62.2 C63.2 C64.2 C65.2 C76.2 C77.2 DD4.1(VBAT) DD4.19(VDD) DD4.32(VDD) DD4.48(VDD) DD4.64(VDD) DD6.1(Vcc1) G1.4(VCC) R59.2 R60.2 R61.2 R72.2 VD5.2(A)
+5B: C69.2 DD5.2(Vin+) X5.3 X6.4
+5B_CAN: C78.2 C79.2 DD5.4(Vout+) DD6.16(Vcc2)
AGND: C56.1 C57.2 C67.2 C71.1 C72.1 C73.1 C74.1 DA9.2(V-) DD4.12(VSSA) R71.1 X7.4
DGND: C53.1 C54.1 C55.1 C58.1 C59.1 C60.2 C61.1 C62.1 C63.1 C64.1 C65.1 C69.1 C70.1 C76.1 C77.1 DD4.18(VSS) DD4.60(BOOT0) DD4.63(VSS) DD5.1(Vin-) DD6.2(GND1) DD6.7(GND1) DD6.8(GND1) G1.2(GND) X4.9 X4.10 X5.4 X6.5
EGND: X5.5 X6.6 X7.1 X8.1
GND_CAN: C70.2 C75.1 C78.1 C79.1 DA10.3 DD5.3(Vout-) DD6.9(GND2) DD6.10(GND2) DD6.15(GND2) X8.2
CANH: DA10.1 DD6.13(CANH) R73.2 X8.3
CANL: DA10.2 DD6.12(CANL) R74.1 X8.4
HU: R62.1 X6.1
HV: R63.1 X6.2
HW: R64.1 X6.3
I_SENSE_A: DD4.9(PC1_/_ETH_MDC/EVENTOUT/ADC123_IN11/FT) ; port I_SENSE_A
I_SENSE_B: DD4.14(PA0_/_WAKEUP/USART2_CTS/UART4_TX/ETH_MII_CRS/TIM2_CH1_ETR/TIM5_CH1/TIM8_ETR/ADC123_IN0/FT) ; port I_SENSE_B
I_SENSE_C: DD4.15(PA1_/_USART2_RTS/UART4_RX/ETH_RMII_REF_CLK/ETH_MII_RX_CLK/TIM5_CH2/TIM2_CH2/ADC123_IN1/FT) ; port I_SENSE_C
MCU_ACC_I2C2_SCL: DD4.29(PB10_/_SPI2_SCK/I2S2_CK/I2C2_SCL/USART3_TX/OTG_HS_ULPI_D3/ETH_MII_RX_ER/TIM2_CH3/FT) R61.1 X5.2
MCU_ACC_I2C2_SDA: DD4.30(PB11_/_I2C2_SDA/USART3_RX/OTG_HS_ULPI_D4/ETH_RMII_TX_EN/ETH_MII_TX_EN/TIM2_CH4/FT) R60.1 X5.1
MCU_CAN1_RX: DD4.44(PA11_/_USART1_CTS/CAN1_RX/TIM1_CH4/OTG_FS_DM/FT) DD6.3(RxD)
MCU_CAN1_TX: DD4.45(PA12_/_USART1_RTS/CAN1_TX/TIM1_ETR/OTG_FS_DP/FT) DD6.6(TxD) R72.1
MCU_HALL_U: DD4.33(PB12_/_SPI2_NSS/I2S2_WS/I2C2_SMBA/USART3_CK/TIM1_BKIN/CAN2_RX_/OTG_HS_ULPI_D5/ETH_RMII_TXD0/ETH_MII_TXD0/OTG_HS_ID/FT) R62.2
MCU_HALL_V: DD4.38(PC7_/_I2S3_MCK/TIM8_CH2/SDIO_D7/USART6_RX/DCMI_D1/TIM3_CH2/FT) R63.2
MCU_HALL_W: DD4.39(PC8_/_TIM8_CH3/SDIO_D0/TIM3_CH3/USART6_CK/DCMI_D2/FT) R64.2
MCU_RESET: C55.2 DD4.7(NRST) R54.2 R59.1
MCU_SWCLK: DD4.49(PA14_/_JTCK-SWCLK/FT) R58.2
MCU_SWDIO: DD4.46(PA13_/_JTMS-SWDIO/FT) R53.2
MCU_TRACESWO: DD4.55(PB3_/_JTDO/TRACESWO/SPI3_SCK/I2S3_CK/TIM2_CH2/SPI1_SCK/FT) R56.2
MCU_UART1_RX: DD4.59(PB7_/_I2C1_SDA/FSMC_NL/DCMI_VSYNC/USART1_RX/TIM4_CH2/FT) R55.2
MCU_UART1_TX: DD4.58(PB6_/_I2C1_SCL/TIM4_CH1/CAN2_TX/DCMI_D5/USART1_TX/FT) R57.2
PWM_AB: DD4.36(PB15_/_SPI2_MOSI/I2S2_SD/TIM1_CH3N/TIM8_CH3N/TIM12_CH2/OTG_HS_DP/RTC_REFIN/FT) ; port PWM_AB
PWM_AT: DD4.43(PA10_/_USART1_RX/TIM1_CH3/OTG_FS_ID/DCMI_D1/FT) ; port PWM_AT
PWM_BB: DD4.34(PB13_/_SPI2_SCK/I2S2_CK/USART3_CTS/TIM1_CH1N/CAN2_TX/OTG_HS_ULPI_D6/ETH_RMII_TXD1/ETH_MII_TXD1/OTG_HS_VBUS/FT) ; port PWM_BB
PWM_BT: DD4.41(PA8_/_MCO1/USART1_CK/TIM1_CH1/I2C3_SCL/OTG_FS_SOF/FT) ; port PWM_BT
PWM_CB: DD4.35(PB14_/_SPI2_MISO/TIM1_CH2N/TIM12_CH1/OTG_HS_DM/USART3_RTS/TIM8_CH2N/I2S2ext_SD/FT) ; port PWM_CB
PWM_CT: DD4.42(PA9_/_USART1_TX/TIM1_CH2/I2C3_SMBA/DCMI_D0/OTG_FS_VBUS/FT) ; port PWM_CT
TEMP+: R69.1 X7.3
TEMP-: R65.1 X7.2
TEMPERATURE: C72.2 DD4.27(PB1_/_TIM3_CH4/TIM8_CH3N/OTG_HS_ULPI_D2/ETH_MII_RXD3/TIM1_CH3N/ADC12_IN9/FT) R68.2
V_POWER: DD4.8(PC0_/_OTG_HS_ULPI_STP/EVENTOUT/ADC123_IN10/FT) ; port V_POWER
NetC53_2: C53.2 DD4.47(VCAP_2)
NetC54_2: C54.2 DD4.31(VCAP_1)
NetC56_2: C56.2 C57.1 DD4.13(VDDA) L3.1
NetC66_1: C66.1 DA9.4(OUT) R67.2 R68.1
NetC66_2: C66.2 DA9.3(-IN) R66.2 R67.1
NetC67_1: C67.1 C68.2 R65.2 R66.1
NetC68_1: C68.1 C73.2 R69.2 R70.1
NetC71_2: C71.2 DA9.1(+IN) R70.2 R71.2
NetC75_2: C75.2 R73.1 R74.2
NetDD4_5: DD4.5(PH0_/OSC_IN/FT) G1.3(DCLK)
NetR53_1: R53.1 X4.3
NetR54_1: R54.1 X4.4
NetR55_1: R55.1 X4.5
NetR56_1: R56.1 X4.6
NetR57_1: R57.1 X4.7
NetR58_1: R58.1 X4.8
NetVD5_1: VD5.1(K) X4.1 X4.2

Not connected (* = marked no-connect by the designer): DD4 2(PC13_/_EVENTOUT/RTC_OUT/RTC_TAMP1/RTC_TS/FT) 3(PC14_/_OSC32_IN/FT) 4(PC15_/_OSC32_OUT/FT) 6(PH1_/OSC_OUT/FT)* 10(PC2_/_SPI2_MISO/OTG_HS_ULPI_DIR/ETH_MII_TXD2/I2S2ext_SD/ADC123_IN12/FT) 11(PC3_/_SPI2_MOSI/I2S2_SD/OTG_HS_ULPI_NXT/ETH_MII_TX_CLK/ADC123_IN13/FT) 16(PA2_/_USART2_TX/TIM5_CH3/ADC123_IN2/TIM9_CH1/TIM2_CH3/ADC123_IN2/FT) 17(PA3_/_USART2_RX/TIM5_CH4/TIM9_CH2/TIM2_CH4/OTG_HS_ULPI_D0/ETH_MII_COL/ADC123_IN3/FT) 20(PA4_/_SPI1_NSS/SPI3_NSS/USART2_CK/DCMI_HSYNC/OTG_HS_SOF/I2S3_WS/ADC12_IN4/DAC_OUT1/TTa) 21(PA5_/_SPI1_SCK/OTG_HS_ULPI_CK/TIM2_CH1_ETR/TIM8_CH1N/ADC12_IN5/DAC_OUT2/TTa) 22(PA6_/_SPI1_MISO/TIM8_BKIN/TIM13_CH1/DCMI_PIXCLK/TIM3_CH1/TIM1_BKIN/ADC12_IN6/FT) 23(PA7_/_SPI1_MOSI/TIM8_CH1N/TIM14_CH1/TIM3_CH2/ETH_MII_RX_DV/TIM1_CH1N/ETH_RMII_CRS_DV/ADC12_IN7/FT) 24(PC4_/_ETH_RMII_RX_D0/ETH_MII_RX_D0/ADC12_IN14/FT) 25(PC5_/_ETH_RMII_RX_D1/ETH_MII_RX_D1/ADC12_IN15/FT) 26(PB0_/_TIM3_CH3/TIM8_CH2N/OTG_HS_ULPI_D1/ETH_MII_RXD2/TIM1_CH2N/ADC12_IN8/FT) 28(PB2_/_BOOT1/FT) 37(PC6_/_I2S2_MCK/TIM8_CH1/SDIO_D6/USART6_TX/DCMI_D0/TIM3_CH1/FT) 40(PC9_/_I2S_CKIN/MCO2/TIM8_CH4/SDIO_D1/I2C3_SDA/DCMI_D3/TIM3_CH4/FT) 50(A15_/_JTDI/SPI3_NSS/I2S3_WS/TIM2_CH1_ETR/_SPI1_NSS/FT) 51(PC10_/_SPI3_SCK/I2S3_CK/UART4_TX/SDIO_D2/DCMI_D8/USART3_TX/FT) 52(PC11_/_UART4_RX/SPI3_MISO/SDIO_D3/DCMI_D4/USART3_RX/I2S3ext_SD/FT) 53(PC12_/_UART5_TX/SDIO_CK/DCMI_D9/SPI3_MOSI/I2S3_SD/USART3_CK/FT) 54(PD2_/_TIM3_ETR/UART5_RX/SDIO_CMD/DCMI_D11/FT) 56(PB4_/_NJTRST/SPI3_MISO/TIM3_CH1/SPI1_MISO/I2S3ext_SD/FT) 57(PB5_/_I2C1_SMBA/CAN2_RX/OTG_HS_ULPI_D7/ETH_PPS_OUT/TIM3_CH2/SPI1_MOSI/SPI3_MOSI/DCMI_D10/I2S3_SD/FT) 61(PB8_/_TIM4_CH3/SDIO_D4/TIM10_CH1/DCMI_D6/ETH_MII_TXD3/I2C1_SCL/CAN1_RX/FT) 62(PB9_/_SPI2_NSS/I2S2_WS/TIM4_CH4/TIM11_CH1/SDIO_D5/DCMI_D7/I2C1_SDA/CAN1_TX/FT); DD6 4(NC)* 5(NC)* 11(NC)* 14(NC)*; G1 1(NC)*

### Notes on the sheet
- PWM_AT - TIM1_CH3 - PA10
  PWM_AB - TIM1_CH3N - PB1, PB15
  PWM_BT - TIM1_CH1 - PA8
  PWM_BB - TIM1_CH1N - PB13, PA7
  PWM_CT - TIM1_CH2 - PA9
  PWM_CB - TIM1_CH2N - PB0, PB14
- На лист 2
- На лист 3
- (near X6) Microclasp
- (near X7) Microclasp
- Подп. и дата
- (near X8) Microclasp
- Инв. № дубл.
- Взам. инв. №
- Даташит читать!
- Общее потребление: 76 mA + 200 mA + 150 mA + 200 mA = 700 mA
- Инв. № подл.
- Лист
- Изм.
- № докум.
- Подп.
- Дата
- Копировал
- Формат
- (in symbol connect97) Цепь
- (in symbol connect98) Цепь
- (in symbol connect99) Цепь
- (in symbol connect107) Цепь
- (in symbol crystal10) G
- (in symbol interf22) RTX
- (in symbol microcont10) MPU
- (in symbol pwr52) DC-DC

### Library data of the parts
C53 C54 C69 = cap287: Конденсатор; Part Name: Ceramic; Manufacture: Murata; Part Number: GRM188Z71C225ME43J; id: cap287; TKE: X7R; tga: 0,10%; Value: 2,2мк
C55 C56 C58 C61-C65 C74 C77 C78 = cap277: as C37 on sheet KUBODriver_DC
C57 C60 = cap199: Конденсатор полярный; Part Name: Tantal; Manufacture: Vishay; Part Number: 293D106X9016A2TE3; id: cap199
C59 C76 C79 = cap133: as C42 on sheet KUBODriver_DC
C66 C68 C71 C75 = cap42: Конденсатор; Part Name: Ceramic; Manufacture: Murata; Part Number: GRM155R71H103K; id: cap42; TKE: X7R
C67 C73 = cap29: Конденсатор; Part Name: Ceramic; Manufacture: Murata; Part Number: GRM1535C1H101J; id: cap29; TKE: NP0
C70 = cap284: Конденсатор; Part Name: Ceramic; Manufacture: Yageo; Part Number: CC1206KKX7RDBB471; id: cap284; TKE: X7R
C72 = cap28: Конденсатор; Part Name: Ceramic; Manufacture: Murata; Part Number: GRM1555C1H102J; id: cap28; TKE: NP0
DA9 = amp10: HIGH-DRIVE OPERATIONAL AMPLIFIERS WITH SHUTDOWN; Part Name: Micropower / Operational Amplifiers; Manufacture: ST Microelectronics; id: amp10; Rail-to-rail: yes; Supply Voltage: 2,7-6B; Supply Current max: 200uA; Bandwidth: 1MHz; Input Bias Current: 10nA; CMRR: 85dB; PSRR: 80dB; Offset voltage: 0,1mB; Channels: 1; Part Number: LMV321ILT
DA10 = PESD1CAN: TVS; Part Name: CAN bus ESD protection diode; Manufacture: Nexperia; id: esd5; Max Reverse Voltage: 24B; Breakdown Voltage: 25,4B; Capacitance: 17pF; Number of Channels: 2
DD4 = microcont10: Part Name: Microcontroller; Frequency: 168MHz; ADC: 16x12b/2x12b; Interface: can, i2c, irda, lin, spi, uart, usbotg,sdio; Flash: 1Mb; Pin in: 51; Power Supply: 1.8-3.6V; id: microcont10; Part Number: STM32F405RGT6
DD5 = pwr52: DC/DC преобразователь; Part Name: DC/DC Converter Isolated; Manufacturer: PEAK Electronics; id: pwr52; Input Voltage: 5B; Current: 200mA; Type: Isolated; Output Voltage: 5B
DD6 = interf22: Isolated CAN Transceiver; Manufacture: Texas Instruments; Number of Channel: 1; Type Supply: Single Polar; Current Consumption: 76mA; Power Supply: 3-5,5В/4,75-5,25В; id: interf22; Part Name: Isolated CAN Transceiver; Part Number: ISO1050DW
G1 = crystal10: Кварц. генер. 32.768 МГц (HCMOS/TTL); Manufacture: GEYER; Part Number: KXO-V97; Frequence: 12MHz; id: crystal10
L3 = ind0: EMI Suppression Filter; Part Name: EMI Suppression Filters; Part Number: BLM18PG181SN1D; id: ind0; Resistance: 0,09Ohm
R53-R58 R62-R64 = res238: Резистор; Manufacture: Yageo; Part Number: RC0402FR-0747RL; id: res238; Accuracy: 0,01; Part Name: Resistor; Power: 0,062Вт
R59-R61 R72 = res294: as R34 on sheet KUBODriver_DC; Part Name: Resistor; Power: 0,062Вт
R65 R66 R69 R70 = res281: Резистор; Manufacture: Yageo; Part Number: RC0402FR-073KL; id: res281; Accuracy: 0,01; Part Name: Resistor; Power: 0,062Вт
R67 R71 = res318: as R28 on sheet KUBODriver_DC; Part Name: Resistor; Power: 0,062Вт
R68 = res270: as R30 on sheet KUBODriver_DC; Part Name: Resistor; Power: 0,062Вт
R73 R74 = res241: Резистор; Manufacture: Yageo; Part Number: RC0402FR-0762RL; id: res241; Accuracy: 0,01; Part Name: Resistor; Power: 0,062Вт
VD5 = diode15: as VD4 on sheet KUBODriver_DC; id: diode15; Part Name: Diode Schottky
X4 = connect107: Разъем - 10 конт. розетка; Part Name: Штыри двухрядные 2x5; Manufacture: Auk Contractors; Contact_1: +3,3B; Contact_3: SWDIO; Contact_4: RESET; Contact_5: RX; Contact_6: SWO; Etch: 1.27mm; Contact_7: TX; Contact_8: SWCLK; Contact_9: DGND; Contact_2: +3,3B; id: connect107; Part Number: PAVX15-2X05-H; Contact_10: DGND
X5 = connect98: Разъем - 5 конт. розетка; Manufacture: Molex; Contact_1: SDA; Contact_2: SCL; Contact_3: +5B; Contact_4: DGND; Contact_5: EGND; Etch: 2mm; id: connect98
X6 = connect99: Разъем - 6 конт. розетка; Part Name: MicroClasp; Manufacture: Molex; Contact_1: HU; Contact_2: HV; Contact_3: HW; Contact_4: +5B; Contact_5: DGND; Contact_6: EGND; Etch: 2mm; id: connect99
X7 = connect97: Разъем - 4 конт. розетка; Part Name: MicroClasp Wire-to-Board Header; Manufacture: Molex; Contact_1: EGND; Contact_2: TEMP-; Contact_3: TEMP+; Contact_4: AGND; Etch: 2mm; id: connect97
X8 = connect97: Разъем - 4 конт. розетка; Part Name: MicroClasp Wire-to-Board Header; Manufacture: Molex; Contact_1: EGND; Contact_2: GND_CAN; Contact_3: CANH; Contact_4: CANL; Etch: 2mm; id: connect97

## Nets that join several sheets
+3,3BA: KUBODriver_DC (C42.2 DA8.1 DA8.3 R35.2), KUBODriver_MCU (C74.2 DA9.5 L3.2)
+3,3BD: KUBODriver_DC (R38.2), KUBODriver_MCU (22 pins)
+5B: KUBODriver_DC (7 pins), KUBODriver_MCU (C69.2 DD5.2 X5.3 X6.4)
+12B: KUBODriver_DC (8 pins), KUBODriver_Driver (9 pins)
+48B: KUBODriver_Bridge (7 pins), KUBODriver_DC (16 pins)
AGND: KUBODriver_DC (5 pins), KUBODriver_MCU (11 pins)
DGND: KUBODriver_DC (C39.2 C40.2 DA7.2 R39.2), KUBODriver_Driver (6 pins), KUBODriver_MCU (27 pins)
EGND: KUBODriver_Bridge (6 pins), KUBODriver_DC (C31.2 R26.2 X1.6), KUBODriver_MCU (X5.5 X6.6 X7.1 X8.1)
PGND: KUBODriver_Bridge (7 pins), KUBODriver_DC (28 pins), KUBODriver_Driver (9 pins)
GATEAB: KUBODriver_Bridge (VT4.1), KUBODriver_Driver (R42.2)
GATEAT: KUBODriver_Bridge (VT1.1), KUBODriver_Driver (R41.2)
GATEBB: KUBODriver_Bridge (VT5.1), KUBODriver_Driver (R46.2)
GATEBT: KUBODriver_Bridge (VT2.1), KUBODriver_Driver (R45.2)
GATECB: KUBODriver_Bridge (VT6.1), KUBODriver_Driver (R50.2)
GATECT: KUBODriver_Bridge (VT3.1), KUBODriver_Driver (R49.2)
PHASE_A: KUBODriver_Bridge (VT1.3 VT4.2), KUBODriver_DC (X3.5 X3.6), KUBODriver_Driver (C44.2 DD1.4)
PHASE_B: KUBODriver_Bridge (VT2.3 VT5.2), KUBODriver_DC (X3.3 X3.4), KUBODriver_Driver (C47.2 DD2.4)
PHASE_C: KUBODriver_Bridge (VT3.3 VT6.2), KUBODriver_DC (X3.1 X3.2), KUBODriver_Driver (C50.2 DD3.4)
PWM_AB: KUBODriver_Driver (DD1.6 R44.2), KUBODriver_MCU (DD4.36)
PWM_AT: KUBODriver_Driver (DD1.5 R43.2), KUBODriver_MCU (DD4.43)
PWM_BB: KUBODriver_Driver (DD2.6 R48.2), KUBODriver_MCU (DD4.34)
PWM_BT: KUBODriver_Driver (DD2.5 R47.2), KUBODriver_MCU (DD4.41)
PWM_CB: KUBODriver_Driver (DD3.6 R52.2), KUBODriver_MCU (DD4.35)
PWM_CT: KUBODriver_Driver (DD3.5 R51.2), KUBODriver_MCU (DD4.42)